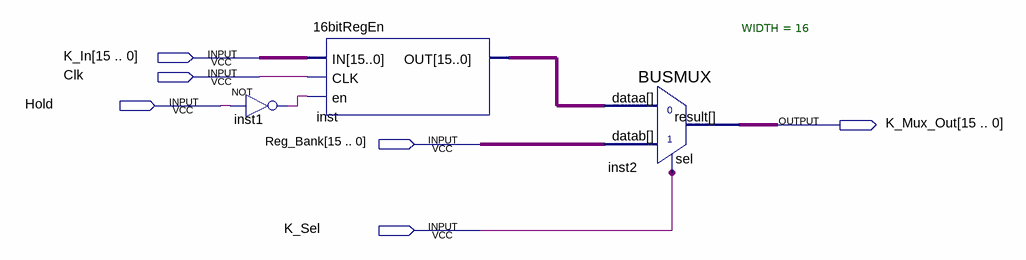
[diagram p0: schematic sheet]
// Quartus schematic Kmux.bdf as structural Verilog: 3 symbols, 6 pins
module Kmux (
  input  [15:0] K_In,
  input  Clk,
  input  Hold,
  input  [15:0] Reg_Bank,
  input  K_Sel,
  output [15:0] K_Mux_Out
);

  wire inst1_out;
  wire [15:0] inst_out;

  not inst1 (inst1_out, Hold);
  \16bitRegEn  inst (.IN(K_In), .CLK(Clk), .en(inst1_out), .OUT(inst_out));
  BUSMUX #(.WIDTH(16)) inst2 (.datab(Reg_Bank), .sel(K_Sel), .dataa(inst_out), .result(K_Mux_Out));
endmodule
